# Altium project Fuente Simetrica.PrjPCB
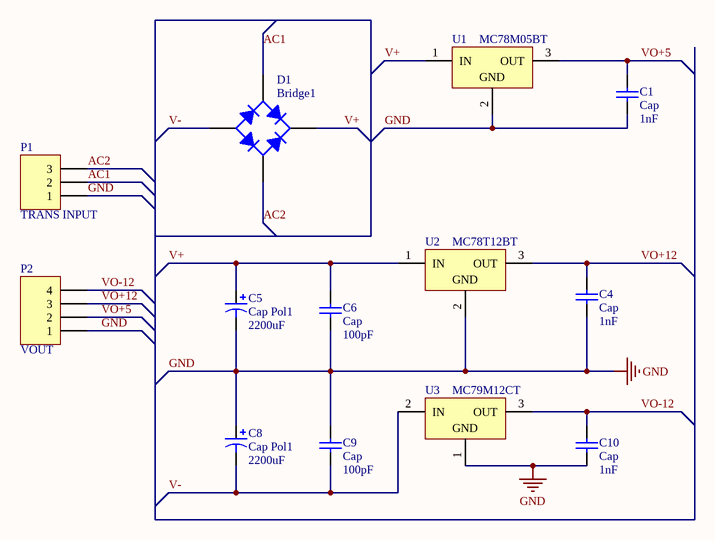
[diagram p0: Fuente Simetrica.SchDoc]
1 sheet, 13 parts. Net scope: global (net labels, ports and power ports of the same name join across sheets).
Board file: Fuente Simetrica.PcbDoc

## Sheet Fuente Simetrica.SchDoc
size A

### Parts
C1  Cap  value 1nF  [RAD-0.2]
C4  Cap  value 1nF  [RAD-0.2]
C5  Cap Pol1  value 2200uF  [RB5-10.5]
C6  Cap  value 100pF  [RAD-0.2]
C8  Cap Pol1  value 2200uF  [RB5-10.5]
C9  Cap  value 100pF  [RAD-0.2]
C10  Cap  value 1nF  [RAD-0.2]
D1  Bridge1  [PUENTE1A]
P1  TRANS INPUT  [AZUL5-3]
P2  VOUT  [AZUL5-4]
U1  MC78M05BT  [221A-04]
U2  MC78T12BT  [221A-04]
U3  MC79M12CT  [221A-04]

### Nets
GND: C1.1 C4.1 C5.2 C6.1 C8.1 C9.2 C10.1 P1.1 P2.1 U1.2(GND) U2.2(GND) U3.1(GND)
AC1: D1.4(C) P1.2
AC2: D1.2(C) P1.3
V+: C5.1 C6.2 D1.1(K) U1.1(IN) U2.1(IN)
V-: C8.2 C9.1 D1.3(A) U3.2(IN)
VO+5: C1.2 P2.2 U1.3(OUT)
VO+12: C4.2 P2.3 U2.3(OUT)
VO-12: C10.2 P2.4 U3.3(OUT)

### Library data of the parts
C1 C4 C6 C9 C10 = Cap: Capacitor; Published: 8-Jun-2000; LatestRevisionDate: 17-Jul-2002; LatestRevisionNote: Re-released for DXP Platform.; PackageReference: RAD-0.3; Publisher: Altium Limited; PackageDescription: Radial Cap, Thru-Hole; 2 Leads; 0.3 in Pin Spacing
C5 C8 = Cap Pol1: Polarized Capacitor (Radial); Published: 8-Jun-2000; LatestRevisionDate: 17-Jul-2002; LatestRevisionNote: Re-released for DXP Platform.; PackageReference: RB7.6-15; Publisher: Altium Limited; PackageDescription: Polarized Capacitor (Radial); 2 Leads
D1 = Bridge1: Full Wave Diode Bridge; pin to pad: 1>V+ 2>AC2 3>V- 4>AC1; Published: 8-Jun-2000; LatestRevisionDate: 29-May-2009; LatestRevisionNote: Sch pins A & K swapped.; DatasheetVersion: E2732B; PackageReference: D-38; Publisher: Altium Limited; PackageDescription: Bridge Rectifier; 4 Terminals; Body 9.4 x 9.4 mm (typ); Pitch 5.08 mm
P1 = Header 3: Header, 3-Pin; LatestRevisionDate: 17-Jul-2002; LatestRevisionNote: Re-released for DXP Platform.; Publisher: Altium Limited
P2 = Header 4: Header, 4-Pin; LatestRevisionDate: 17-Jul-2002; LatestRevisionNote: Re-released for DXP Platform.; Publisher: Altium Limited
U1 = MC78M05BT: 3-Terminal Medium-Current Positive Fixed Voltage Regulator; Note: Pin 2 is electrically connected to TAB; Published: 17-Jul-2002; DatasheetVersion: 1988; PackageReference: 221A-04; Publisher: Altium Limited; PackageDescription: TO, Thru-Hole, Vertical, Heatsink Mounted; 3 In-Line Leads; Pitch 2.54 mm; Code_JEDEC: TO-262-AA; ComponentLink1Description: Manufacturer Link; ComponentLink1URL: http://www.onsemi.com/site/products/taxonomy/0,4438,503,00.html; ComponentLink2Description: Datasheet; ComponentLink2URL: http://www.onsemi.com/pub/Collateral/MC78M00-D.PDF
U2 = MC78T12BT: Three-Ampere Positive Fixed Voltage Regulator; Note: Pin 2 is electrically connected to Heatsink surface; Published: 17-Jul-2002; DatasheetVersion: 1988; PackageReference: 221A-04; Publisher: Altium Limited; PackageDescription: TO, Thru-Hole, Vertical, Heatsink Mounted; 3 In-Line Leads; Pitch 2.54 mm; Code_JEDEC: TO-262-AA; ComponentLink1Description: Manufacturer Link; ComponentLink1URL: http://www.onsemi.com/site/products/taxonomy/0,4438,503,00.html; ComponentLink2Description: Datasheet; ComponentLink2URL: http://www.onsemi.com/pub/Collateral/MC78T00-D.PDF
U3 = MC79M12CT: Three-Terminal Negative Fixed Voltage Regulator; Note: Heatsink surface connected to pin 2.; Published: 17-Jul-2002; DatasheetVersion: 1988; PackageReference: 221A-04; Publisher: Altium Limited; PackageDescription: TO, Thru-Hole, Vertical, Heatsink Mounted; 3 In-Line Leads; Pitch 2.54 mm; Code_JEDEC: TO-262-AA; ComponentLink1Description: Manufacturer Link; ComponentLink1URL: http://www.onsemi.com/site/products/taxonomy/0,4438,503,00.html; ComponentLink2Description: Datasheet; ComponentLink2URL: http://www.onsemi.com/pub/Collateral/MC79M00-D.PDF